# EAGLE design differential-buffer (EAGLE 6.6.0)
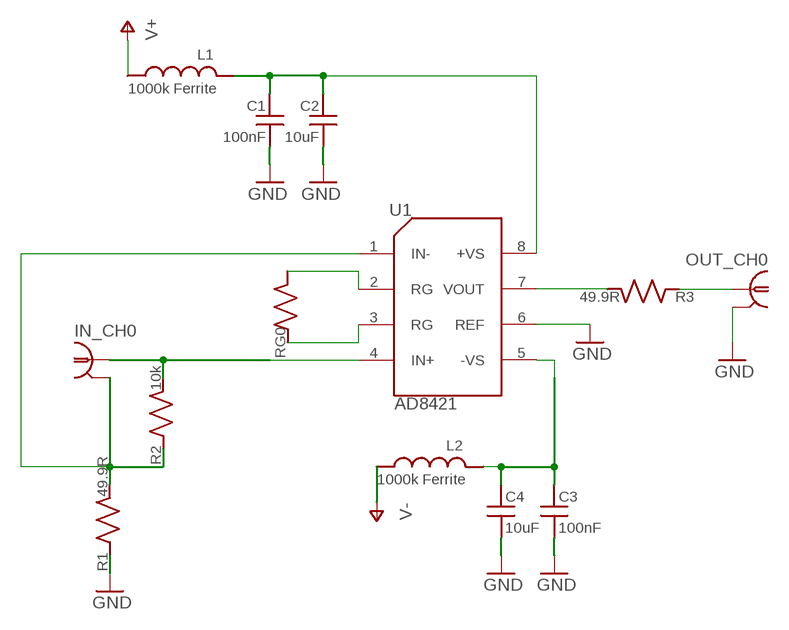
[diagram p0: schematic, sheet 1]

## Parts
C1  100nF  C_MLCC_SMDCMLCC_0603  [C_MLCC_0603]
C2  10uF  C_MLCC_SMDCMLCC_0805  [C_MLCC_0805]
C3  100nF  C_MLCC_SMDCMLCC_0603  [C_MLCC_0603]
C4  10uF  C_MLCC_SMDCMLCC_0805  [C_MLCC_0805]
IN_CH0  BNC-H  [BNC90]
L1  1000k Ferrite  L_FERRITE_SMDLFERRITE_0603  [L_FERRITE_0603]
L2  1000k Ferrite  L_FERRITE_SMDLFERRITE_0603  [L_FERRITE_0603]
OUT_CH0  BNC-H  [BNC90]
R1  49.9R  R_SMDR0603  [R_0603]
R2  10k  R_SMDR0603  [R_0603]
R3  49.9R  R_SMDR0603  [R_0603]
RG0  R_SMDR0402  [R_0402]
U1  AD8421  [SOIC-8]

## Nets
GND: C1.P$2 C2.P$2 C3.P$2 C4.P$2 OUT_CH0.2 R1.P$1 U1.6(REF)
N$1: OUT_CH0.1 R3.P$1
N$2: R3.P$2 U1.7(VOUT)
N$3: C1.P$1 C2.P$1 L1.P$1 U1.8(+VS)
N$4: RG0.P$1 U1.3(RG)
N$5: RG0.P$2 U1.2(RG)
N$56: IN_CH0.1 R2.P$2 U1.4(IN+)
N$57: IN_CH0.2 R1.P$2 R2.P$1 U1.1(IN-)
N$63: C3.P$1 C4.P$1 L2.P$1 U1.5(-VS)
V+: L1.P$2
V-: L2.P$2

## Library data of the parts
C1 C3 = Eurocard-HV-piezo-driver:C_MLCC_SMD; PARTNO: 1276-1936-1-ND
C2 C4 = Eurocard-HV-piezo-driver:C_MLCC_SMD; PARTNO: 445-14417-1-ND
IN_CH0 = Eurocard-HV-piezo-driver:BNC: BNC Connector.; DIGIKEY: 12345; PARTNO: A32260-ND
L1 L2 = Eurocard-HV-piezo-driver:L_FERRITE_SMD; PARTNO: 445-1548-1-ND
OUT_CH0 = connector-jqi:BNC: BNC Connector.; DIGIKEY: A32260-ND
R1 R3 RG0 = jqi_passives:R_SMD
R2 = Eurocard-HV-piezo-driver:R_SMD; PARTNO: TNP10.0KAACT-ND
U1 = differential-buffer:AD8421

## Board
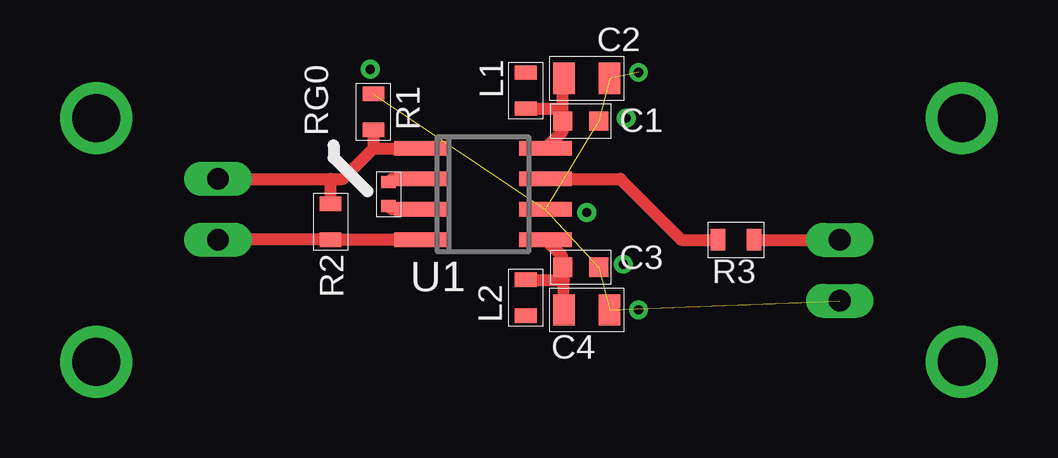
[diagram p1: board, top side]
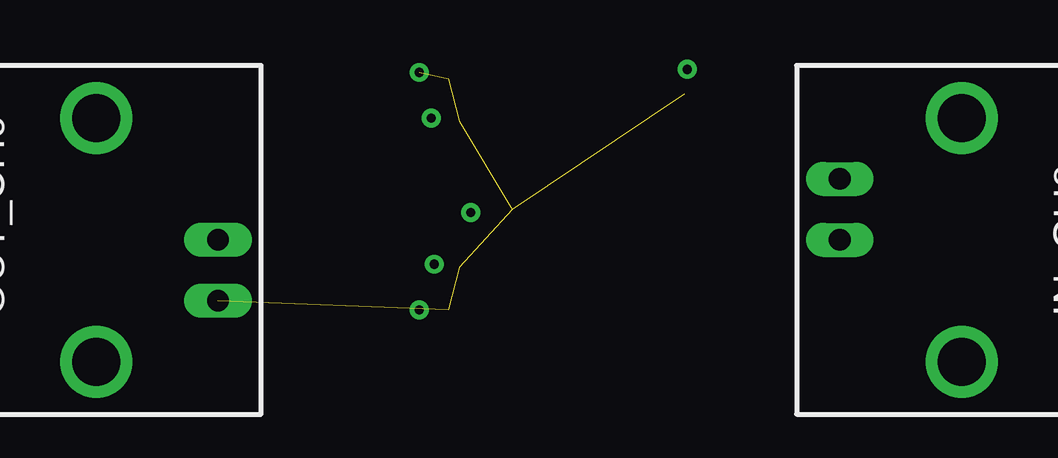
[diagram p2: board, bottom side, seen from below]

No outline drawn. Coordinates in mm, seen from the top.
Copper layers (1*16): Top 0.035mm / dielectric 1.5mm / Bottom 0.035mm
Design rules "default": minimum track width 10mil, minimum drill 24mil, track to track 8mil, track to pad 8mil, pad to pad 8mil, via to via 8mil, smd to smd 8mil, copper to edge 40mil, drill to drill 8mil, minimum pad ring 10mil, minimum via ring 8mil, stop-mask expansion 4mil, vias tented up to drill 0mil, thermal gap 10mil

### Footprints (pad centres in the part's own frame; a part is rotated, then mirrored left to right if it is on the bottom)
C_MLCC_0603 = smd 0.8 x 0.8: P$1 -0.75,0; P$2 0.75,0
C_MLCC_0805 = smd 0.9 x 1.3: P$1 -0.95,0; P$2 0.95,0
BNC90 = drill 0.9 pad 1.27 long: 1 0,-5.08; 2 -2.54,-5.08 | drill 2 pad 2.032: ANCHOR1 -5.08,0; ANCHOR2 5.08,0
L_FERRITE_0603 = smd 0.6 x 0.9: P$1 -0.75,0; P$2 0.75,0
R_0603 = smd 0.6 x 0.9: P$1 -0.75,0; P$2 0.75,0
R_0402 = smd 0.5 x 0.6: P$1 -0.5,0; P$2 0.5,0
SOIC-8 = smd 0.6 x 2.2: 1 -1.905,-2.6; 2 -0.635,-2.6; 3 0.635,-2.6; 4 1.905,-2.6; 5 1.905,2.6; 6 0.635,2.6; 7 -0.635,2.6; 8 -1.905,2.6

### Placement (x,y rotation side)
C1  14.86,73.53 0 top
C2  15.11,75.31 0 top
C3  14.86,67.44 0 top
C4  15.11,65.66 0 top
IN_CH0  -5.33,68.58 270 bottom
L1  12.57,74.8 90 top
L2  12.57,66.17 270 top
OUT_CH0  30.73,68.58 90 bottom
R1  6.22,73.91 270 top
R2  4.45,69.34 270 top
R3  21.34,68.58 180 top
RG0  6.86,70.48 90 top
U1  10.79,70.48 270 top

### Tracks (layer width: path | path; a pad name or v marks a point on that pad's centre or on a via)
GND  (via drill 0.38)  (7 unrouted)
  other vias: 17.27,75.56 16.76,73.66 16.64,67.56 17.27,65.66 15.11,69.72 6.1,75.69
N$1
  Top 0.508: R3.P$1 OUT_CH0.1
N$2
  Top 0.508: U1.7 16.51,71.12 19.05,68.58 R3.P$2
N$3
  Top 0.508: U1.8 14.11,73.1 C1.P$1 14.11,74.04 | 14.11,74.04 14.11,75.26 C2.P$1 | L1.P$1 14.1,74.05 14.11,74.04
N$4
  Top 0.508: U1.3 6.99,69.85 RG0.P$1
N$5
  Top 0.508: U1.2 6.99,71.12 RG0.P$2
N$56
  Top 0.508: IN_CH0.1 -0.25,68.59 R2.P$2 U1.4
N$57
  Top 0.508: IN_CH0.2 4.45,71.12 | 4.45,71.12 4.95,71.12 6.22,72.39 | 6.22,72.39 U1.1 | R2.P$1 4.45,71.12 | R1.P$2 6.22,72.39
N$63
  Top 0.508: U1.5 14.11,67.87 C3.P$1 14.16,67.38 14.16,66.93 | C4.P$1 14.16,66.93 | L2.P$1 14.15,66.92 14.16,66.93